# EasyEDA schematic SCH_SMT-PBTS_v4.0.json
TITLE: CODEC & Tweeter Amps; REV: 4.0; Date: 2023-07-11; Sheet: 2/4; Drawn By: Goose; Company: DaGoose
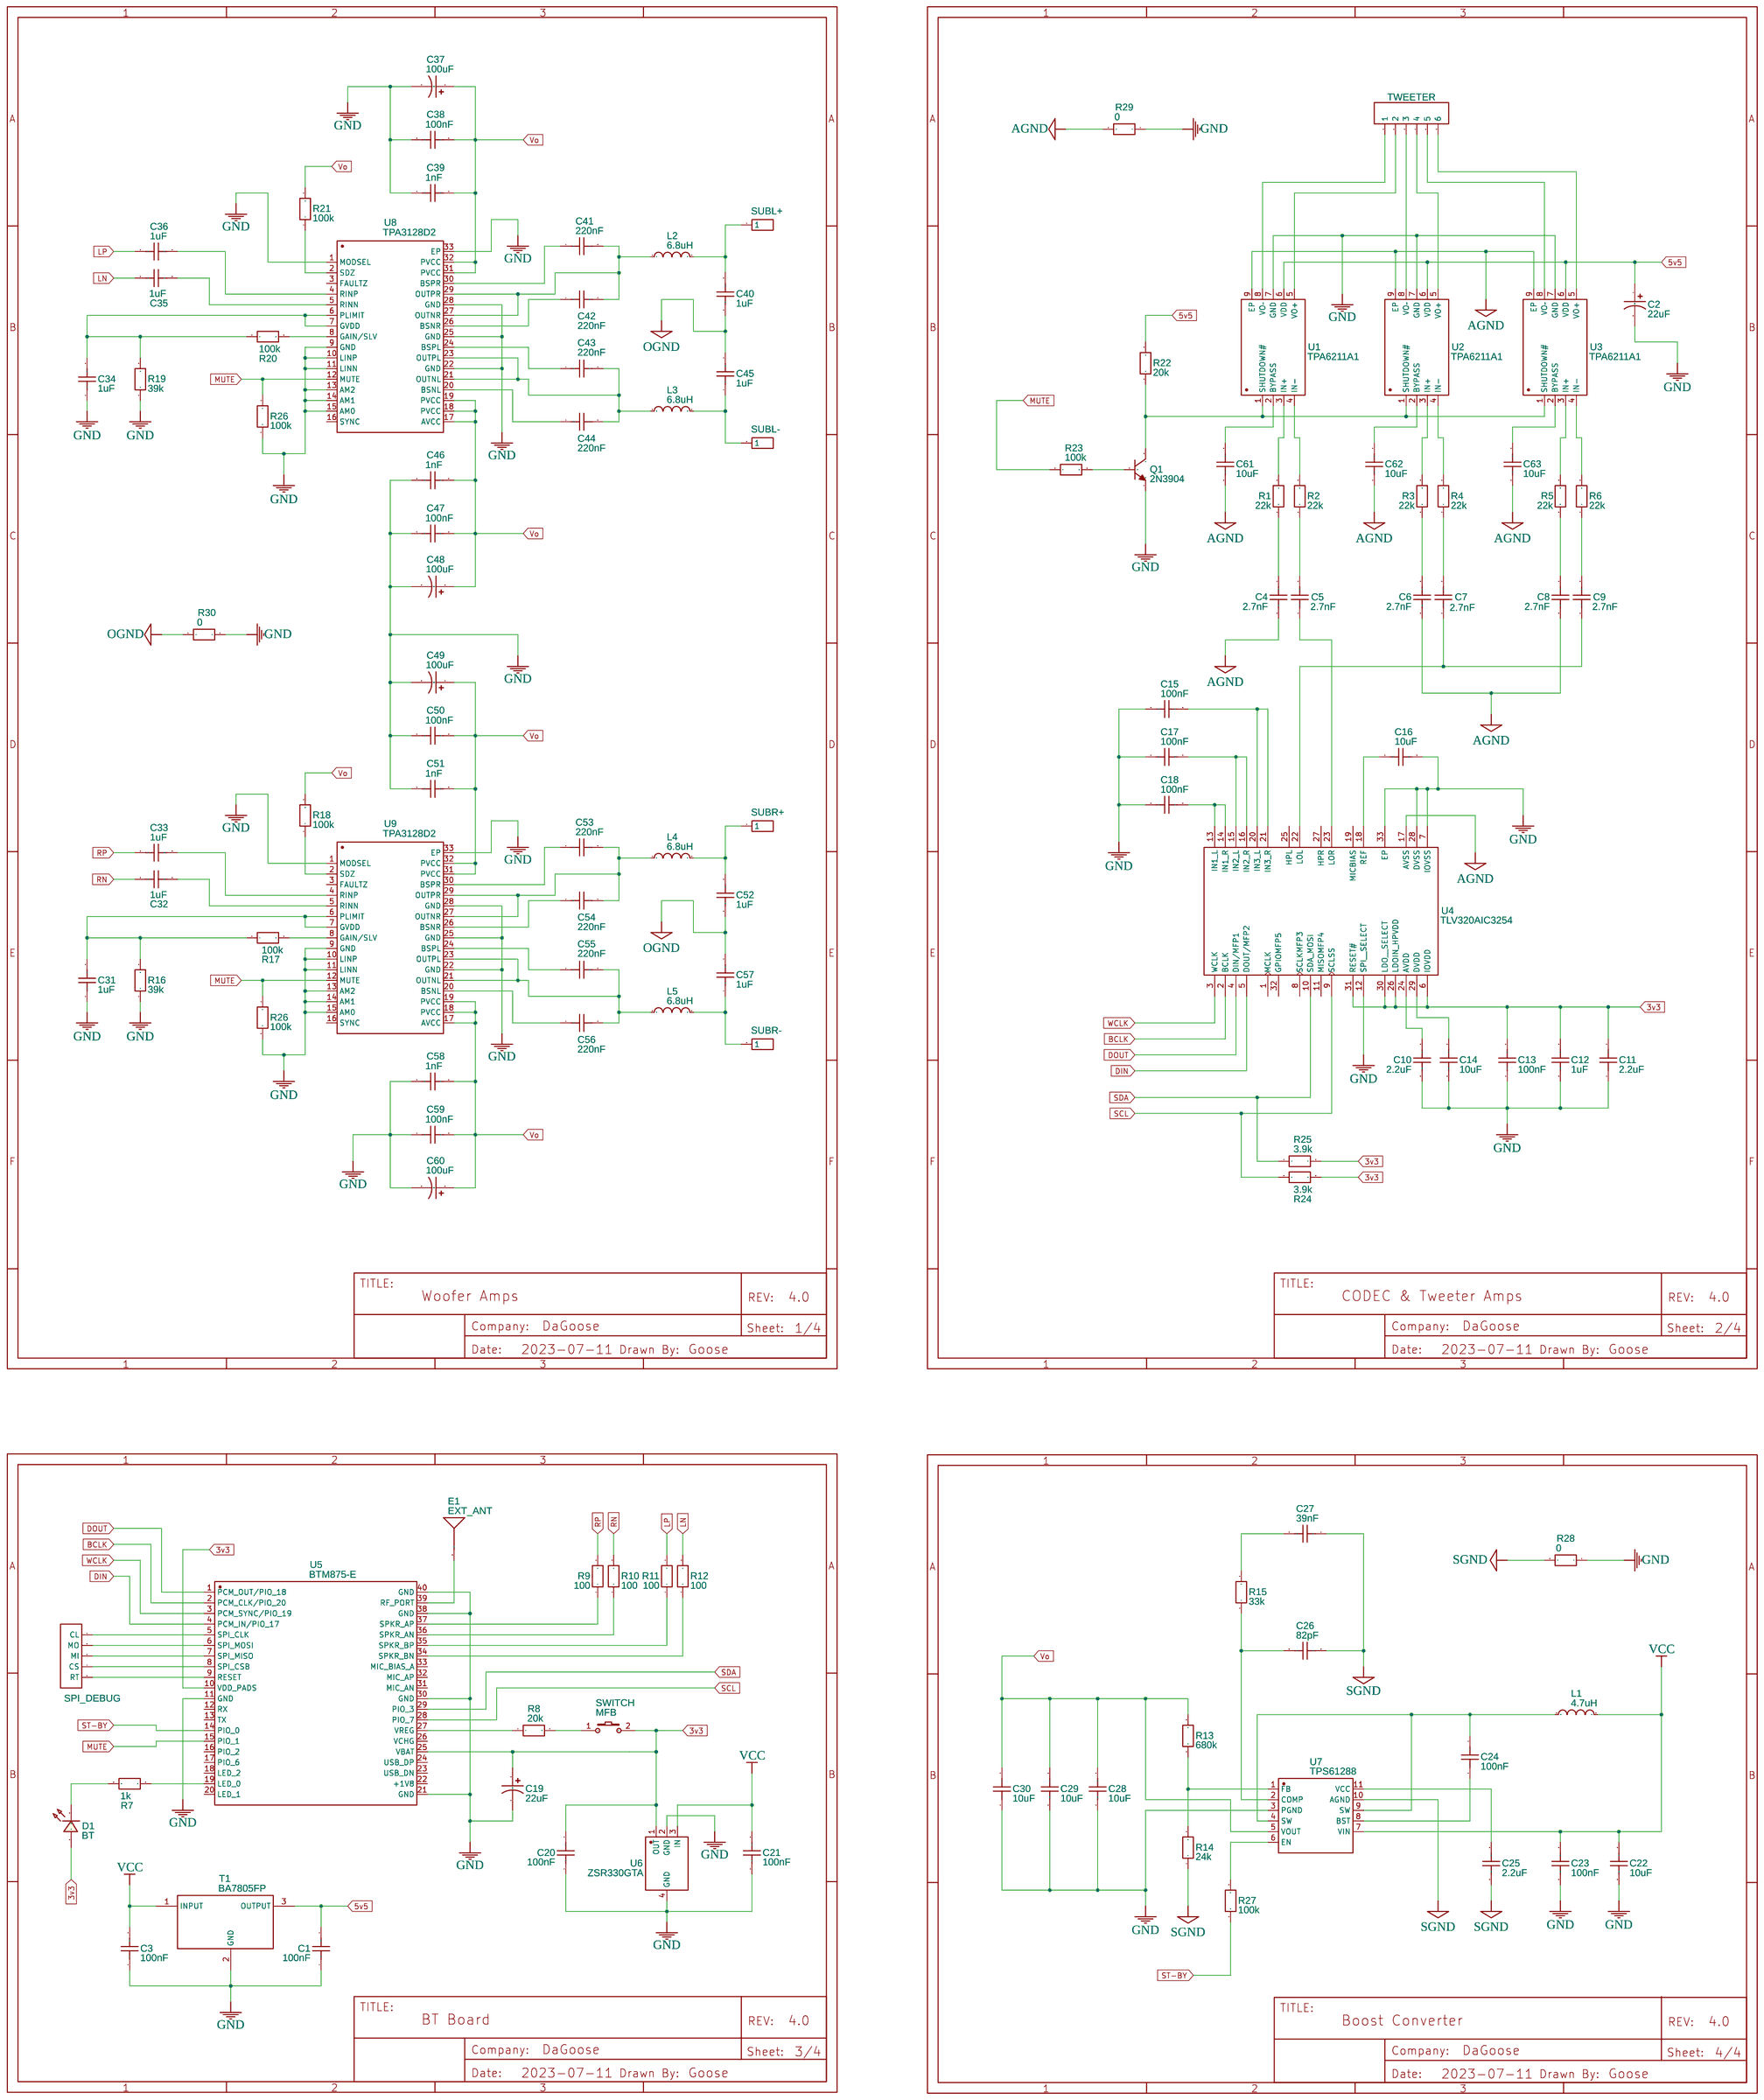
[diagram p0: schematic sheet]

## Parts
C1  100nF  [C0603]
C2  22uF  [CASE-A_3216]
C3  100nF  [C0603]
C4  2.7nF  [C0603]
C5  2.7nF  [C0603]
C6  2.7nF  [C0603]
C7  2.7nF  [C0603]
C8  2.7nF  [C0603]
C9  2.7nF  [C0603]
C10  2.2uF  [C0603]
C11  2.2uF  [C0603]
C12  1uF  [C0603]
C13  100nF  [C0603]
C14  10uF  [C0603]
C15  100nF  [C0603]
C16  10uF  [C0603]
C17  100nF  [C0603]
C18  100nF  [C0603]
C19  22uF  [CASE-A_3216]
C20  100nF  [C0603]
C21  100nF  [C0603]
C22  10uF  [C0603]
C23  100nF  [C0603]
C24  100nF  [C0603]
C25  2.2uF  [C0603]
C26  82pF  [C0603]
C27  39nF  [C0603]
C28  10uF  [C0603]
C29  10uF  [C0603]
C30  10uF  [C0603]
C31  1uF  [C0603]
C32  1uF  [C0603]
C33  1uF  [C0603]
C34  1uF  [C0603]
C35  1uF  [C0603]
C36  1uF  [C0603]
C37  100uF  [CASE-A_3216]
C38  100nF  [C0603]
C39  1nF  [C0603]
C40  1uF  [C0603]
C41  220nF  [C0603]
C42  220nF  [C0603]
C43  220nF  [C0603]
C44  220nF  [C0603]
C45  1uF  [C0603]
C46  1nF  [C0603]
C47  100nF  [C0603]
C48  100uF  [CASE-A_3216]
C49  100uF  [CASE-A_3216]
C50  100nF  [C0603]
C51  1nF  [C0603]
C52  1uF  [C0603]
C53  220nF  [C0603]
C54  220nF  [C0603]
C55  220nF  [C0603]
C56  220nF  [C0603]
C57  1uF  [C0603]
C58  1nF  [C0603]
C59  100nF  [C0603]
C60  100uF  [CASE-A_3216]
C61  10uF  [C0603]
C62  10uF  [C0603]
C63  10uF  [C0603]
D1  BT  [LED0603_RED]
E1  EXT_ANT  [ANTENNA-CHIP3]
H1  SPI_DEBUG  [HDR-F-2.54_1X5]
H2  TWEETER  [HDR-F-2.54_1X6]
J7  SUBL+  [HDR-M-2.54_1X1]
J8  SUBL-  [HDR-M-2.54_1X1]
J9  SUBR+  [HDR-M-2.54_1X1]
J10  SUBR-  [HDR-M-2.54_1X1]
L1  4.7uH  [L0603]
L2  6.8uH  [L0603]
L3  6.8uH  [L0603]
L4  6.8uH  [L0603]
L5  6.8uH  [L0603]
Q1  2N3904  [SOT-23-3_L2.9-W1.3-P1.90-LS2.4-TR]
R1  22k  [R0603]
R2  22k  [R0603]
R3  22k  [R0603]
R4  22k  [R0603]
R5  22k  [R0603]
R6  22k  [R0603]
R7  1k  [R0603]
R8  20k  [R0603]
R9  100  [R0603]
R10  100  [R0603]
R11  100  [R0603]
R12  100  [R0603]
R13  680k  [R0603]
R14  24k  [R0603]
R15  33k  [R0603]
R16  39k  [R0603]
R17  100k  [R0603]
R18  100k  [R0603]
R19  39k  [R0603]
R20  100k  [R0603]
R21  100k  [R0603]
R22  20k  [R0603]
R23  100k  [R0603]
R24  3.9k  [R0603]
R25  3.9k  [R0603]
R26  100k  [R0603]
R26#2  100k  [R0603]
R27  100k  [R0603]
R28  0  [R0603]
R29  0  [R0603]
R30  0  [R0603]
SWITCH  MFB  [KEY-SMD_2P-L6.2-W3.6-LS8.0]
T1  BA7805FP  [TO-252-3_L6.5-W5.8-P4.58-BL]
U1  TPA6211A1  [MSOP-8_L3.0-W3.0-P0.65-LS4.9-BL-EP1.8]
U2  TPA6211A1  [MSOP-8_L3.0-W3.0-P0.65-LS4.9-BL-EP1.8]
U3  TPA6211A1  [MSOP-8_L3.0-W3.0-P0.65-LS4.9-BL-EP1.8]
U4  TLV320AIC3254  [VQFN-32_L5.0-W5.0-P0.50-TL-EP]
U5  BTM875-E  [BULETM-SMD_40P-L11.5-W11.5-P1.00]
U6  ZSR330GTA  [SOT-223-4_L6.5-W3.5-P2.30-LS7.0-BR]
U7  TPS61288  [VQFN-HR-11_L3.0-W2.5-P0.50-TL]
U8  TPA3128D2  [HTSSOP-32_L11.0-W6.1-P0.65-LS8.1-BL-EP]
U9  TPA3128D2  [HTSSOP-32_L11.0-W6.1-P0.65-LS8.1-BL-EP]

## Library data of the parts
C1 C3-C18 C20-C36 C38-C47 C50-C59 C61-C63 = C_0603_US: Contributor: LCEDA_Lib
C2 C19 C37 C48 C49 C60 = C_Tan_SMD_A_US: Contributor: LCEDA_Lib
D1 = LED-0603_R: Manufacturer: EVERLIGHT(台湾亿光); Manufacturer Part: 19-217/R6C-AL1M2VY/3T; Supplier Part: C72044; Supplier: LCSC; Contributor: LCEDA_01
E1 = ANTENNA2: Contributor: SparkFun
H1 = HDR-F-2.54_1x5: Supplier Part: C50950; Supplier: LCSC; Contributor: LCEDA_Lib
H2 = HDR-F-2.54_1x6: Supplier Part: C40877; Supplier: LCSC; Contributor: LCEDA_Lib
J7-J10 = HDR-M-2.54_1x1: Supplier Part: C81276; Supplier: LCSC; Contributor: LCEDA_Lib
L1-L5 = L0603_US: Contributor: LCEDA_Lib
Q1 = 2N3904(SOT-23): Supplier: LCSC; Manufacturer: KEC; Manufacturer Part: 2n3904S-RTK/PS; Supplier Part: C18536; Paste Type: SOT-23; Contributor: LCEDA_Lib
R1-R26 R26#2 R27-R30 = R_0603_EU: Contributor: LCEDA_Lib
SWITCH = K2-3.6×6.1_SMD: Supplier Part: C118141; Supplier: LCSC; Manufacturer Part: K2-1107ST-A4SW-06; Contributor: LCEDA_Lib; 制造商: 韩国韩荣
T1 = BA7805FP-E2: Supplier: LCSC; Manufacturer: ROHM(罗姆); Supplier Part: C79639; JLCPCB Part Class: Extended Part; link: https://lcsc.com/eda_search?q=C79639&%26type=1&ref=editor
U1-U3 = TPA6211A1TDGNRQ1: Contributor: LCSC; Supplier: LCSC; Supplier Part: C473345; Manufacturer: TI(德州仪器); JLCPCB Part Class: Extended Part; link: https://lcsc.com/eda_search?q=C473345&%26type=1&ref=editor
U4 = TLV320AIC3254IRHBT: Contributor: LCSC; Supplier: LCSC; Manufacturer: TI(德州仪器); Supplier Part: C182339; JLCPCB Part Class: Extended Part; link: https://lcsc.com/eda_search?q=C182339&%26type=1&ref=editor
U5 = SJR-BTM875-E: Contributor: lcsc; Supplier: LCSC; Supplier Part: C9900018689; Manufacturer: null; JLCPCB Part Class: Extended Part; link: https://lcsc.com/eda_search?q=C9900018689&%26type=1&ref=editor
U6 = ZSR330GTA: Contributor: LCSC; Supplier: LCSC; Supplier Part: C441823; Manufacturer: DIODES(美台); JLCPCB Part Class: Extended Part; link: https://lcsc.com/eda_search?q=C441823&%26type=1&ref=editor
U7 = TPS61288LRQQR: Supplier: LCSC; Supplier Part: C7498841; Manufacturer: TI(德州仪器); Contributor: lcsc; link: https://lcsc.com/eda_search?q=C7498841&%26type=1&ref=editor
U8 U9 = TPA3128D2DAPR: Supplier: LCSC; Supplier Part: C473362; Manufacturer: Texas Instruments; Contributor: LCSC; JLCPCB Part Class: Extended Part

## Nets
3v3: C11.2 C12.2 C13.2 C19.1 C20.2 D1.1 R24.2 R25.2 SWITCH.2 U4.6(IOVDD) U4.26(LDOIN HPVDD) U4.30(LDO_ SELECT) U4.31(RESET#) U5.10(VDD_PADS) U5.25(VBAT) U6.1(OUT)
5v5: C1.2 C2.1 R22.2 T1.3(OUTPUT) U1.6(VDD) U2.6(VDD) U3.6(VDD)
AGND: C4.2 C6.2 C8.2 C61.1 C62.1 C63.1 R29.2 U1.9(EP) U2.9(EP) U3.9(EP) U4.17(AVSS)
GND: C1.1 C2.2 C3.1 C10.1 C11.1 C12.1 C13.1 C14.1 C15.1 C16.2 C17.1 C18.1 C19.2 C20.1 C21.1 C22.1 C23.1 C28.1 C29.1 C30.1 C31.1 C34.1 C37.2 C38.1 C39.1 C46.1 C47.1 C48.2 C49.2 C50.1 C51.1 C58.1 C59.1 C60.2 Q1.1(E) R16.1 R19.1 R26.2 R26#2.2 R28.1 R29.1 R30.1 T1.2(GND) U1.7(GND) U2.7(GND) U3.7(GND) U4.7(IOVSS) U4.12(SPI_ SELECT) U4.28(DVSS) U4.33(EP) U5.11(GND) U5.21(GND) U5.30(GND) U5.38(GND) U5.40(GND) U6.2(GND) U6.4(GND) U7.3(PGND) U8.1(MODSEL) U8.9(GND) U8.10(LINP) U8.11(LINN) U8.13(AM2) U8.14(AM1) U8.15(AM0) U8.22(GND) U8.25(GND) U8.28(GND) U8.33(EP) U9.1(MODSEL) U9.9(GND) U9.10(LINP) U9.11(LINN) U9.13(AM2) U9.14(AM1) U9.15(AM0) U9.22(GND) U9.25(GND) U9.28(GND) U9.33(EP)
SGND: C25.1 C26.1 C27.1 R14.1 R28.2 U7.10(AGND)
VCC: C3.2 C21.2 C22.2 C23.2 L1.2 T1.1(INPUT) U6.3(IN) U7.7(VIN)
BCLK: U4.2(BCLK) U5.2(PCM_CLK/PIO_20)
DIN: U4.5(DOUT/MFP2) U5.4(PCM_IN/PIO_17)
DOUT: U4.4(DIN/MFP1) U5.1(PCM_OUT/PIO_18)
LN: C35.1 R12.2
LP: C36.1 R11.2
MUTE: R23.1 R26.1 R26#2.1 U5.15(PIO_1) U8.12(MUTE) U9.12(MUTE)
OGND: C40.1 C45.2 C52.1 C57.2 R30.2
RN: C32.1 R10.2
RP: C33.1 R9.2
SCL: R24.1 U4.9(SCLSS) U5.28(PIO_7)
SDA: R25.1 U4.10(SDA MOSI) U5.29(PIO_3)
ST-BY: R27.1 U5.14(PIO_0)
Vo: C28.2 C29.2 C30.2 C37.1 C38.2 C39.2 C46.2 C47.2 C48.1 C49.1 C50.2 C51.2 C58.2 C59.2 C60.1 R13.2 R18.2 R21.2 U7.5(VOUT) U8.17(AVCC) U8.18(PVCC) U8.19(PVCC) U8.31(PVCC) U8.32(PVCC) U9.17(AVCC) U9.18(PVCC) U9.19(PVCC) U9.31(PVCC) U9.32(PVCC)
WCLK: U4.3(WCLK) U5.3(PCM_SYNC/PIO_19)
Net-(C4-1): C4.1 R1.1
Net-(C5-1): C5.1 U4.23(LOR)
Net-(C5-2): C5.2 R2.1
Net-(C6-1): C6.1 R3.1
Net-(C7-1): C7.1 C9.1 U4.22(LOL)
Net-(C7-2): C7.2 R4.1
Net-(C8-1): C8.1 R5.1
Net-(C9-2): C9.2 R6.1
Net-(C10-2): C10.2 U4.24(AVDD)
Net-(C14-2): C14.2 U4.29(DVDD)
Net-(C15-2): C15.2 U4.20(IN3_L) U4.21(IN3_R)
Net-(C16-1): C16.1 U4.18(REF)
Net-(C17-2): C17.2 U4.15(IN2_L) U4.16(IN2_R)
Net-(C18-2): C18.2 U4.13(IN1_L) U4.14(IN1_R)
Net-(C24-1): C24.1 L1.1 U7.4(SW) U7.9(SW)
Net-(C24-2): C24.2 U7.8(BST)
Net-(C25-2): C25.2 U7.11(VCC)
Net-(C26-2): C26.2 R15.1 U7.2(COMP)
Net-(C27-2): C27.2 R15.2
Net-(C31-2): C31.2 R16.2 R17.1 U9.6(PLIMIT) U9.7(GVDD)
Net-(C32-2): C32.2 U9.5(RINN)
Net-(C33-2): C33.2 U9.4(RINP)
Net-(C34-2): C34.2 R19.2 R20.1 U8.6(PLIMIT) U8.7(GVDD)
Net-(C35-2): C35.2 U8.5(RINN)
Net-(C36-2): C36.2 U8.4(RINP)
Net-(C40-2): C40.2 J7.1 L2.2
Net-(C41-1): C41.1 U8.30(BSPR)
Net-(C41-2): C41.2 C42.2 L2.1 U8.27(OUTNR) U8.29(OUTPR)
Net-(C42-1): C42.1 U8.26(BSNR)
Net-(C43-1): C43.1 U8.24(BSPL)
Net-(C43-2): C43.2 C44.2 L3.1 U8.21(OUTNL) U8.23(OUTPL)
Net-(C44-1): C44.1 U8.20(BSNL)
Net-(C45-1): C45.1 J8.1 L3.2
Net-(C52-2): C52.2 J9.1 L4.2
Net-(C53-1): C53.1 U9.30(BSPR)
Net-(C53-2): C53.2 C54.2 L4.1 U9.27(OUTNR) U9.29(OUTPR)
Net-(C54-1): C54.1 U9.26(BSNR)
Net-(C55-1): C55.1 U9.24(BSPL)
Net-(C55-2): C55.2 C56.2 L5.1 U9.21(OUTNL) U9.23(OUTPL)
Net-(C56-1): C56.1 U9.20(BSNL)
Net-(C57-1): C57.1 J10.1 L5.2
Net-(C61-2): C61.2 U1.2(BYPASS)
Net-(C62-2): C62.2 U2.2(BYPASS)
Net-(C63-2): C63.2 U3.2(BYPASS)
Net-(D1-2): D1.2 R7.2
Net-(E1-FEED): E1.FEED(SIGNAL) U5.39(RF_PORT)
Net-(H1-1): H1.1(CL) U5.5(SPI_CLK)
Net-(H1-2): H1.2(MO) U5.6(SPI_MOSI)
Net-(H1-3): H1.3(MI) U5.7(SPI_MISO)
Net-(H1-4): H1.4(CS) U5.8(SPI_CSB)
Net-(H1-5): H1.5(RT) U5.9(RESET)
Net-(H2-1): H2.1 U1.8(VO–)
Net-(H2-2): H2.2 U1.5(VO+)
Net-(H2-3): H2.3 U2.8(VO–)
Net-(H2-4): H2.4 U2.5(VO+)
Net-(H2-5): H2.5 U3.8(VO–)
Net-(H2-6): H2.6 U3.5(VO+)
Net-(Q1-2): Q1.2(B) R23.2
Net-(Q1-3): Q1.3(C) R22.1 U1.1(SHUTDOWN#) U2.1(SHUTDOWN#) U3.1(SHUTDOWN#)
Net-(R1-2): R1.2 U1.3(IN+)
Net-(R2-2): R2.2 U1.4(IN-)
Net-(R3-2): R3.2 U2.3(IN+)
Net-(R4-2): R4.2 U2.4(IN-)
Net-(R5-2): R5.2 U3.3(IN+)
Net-(R6-2): R6.2 U3.4(IN-)
Net-(R7-1): R7.1 U5.19(LED_0)
Net-(R8-1): R8.1 U5.27(VREG)
Net-(R8-2): R8.2 SWITCH.1
Net-(R9-1): R9.1 U5.37(SPKR_AP)
Net-(R10-1): R10.1 U5.36(SPKR_AN)
Net-(R11-1): R11.1 U5.35(SPKR_BP)
Net-(R12-1): R12.1 U5.34(SPKR_BN)
Net-(R13-1): R13.1 R14.2 U7.1(FB)
Net-(R17-2): R17.2 U9.8(GAIN/SLV)
Net-(R18-1): R18.1 U9.2(SDZ)
Net-(R20-2): R20.2 U8.8(GAIN/SLV)
Net-(R21-1): R21.1 U8.2(SDZ)
Net-(R27-2): R27.2 U7.6(EN)

Not connected (* = marked no-connect by the designer): U4 1(MCLK) 8(SCLKMFP3) 11(MISOMFP4) 19(MICBIAS) 25(HPL) 27(HPR) 32(GPIOMFP5); U5 12(RX) 13(TX) 16(PIO_2) 17(PIO_6) 18(LED_2) 20(LED_1) 22(+1V8) 23(USB_DN) 24(USB_DP) 26(VCHG) 31(MIC_AN) 32(MIC_AP) 33(MIC_BIAS_A); U8 3(FAULTZ) 16(SYNC); U9 3(FAULTZ) 16(SYNC)
